# EAGLE schematic ArduinoSkypeIndicator (EAGLE 9.6.1)
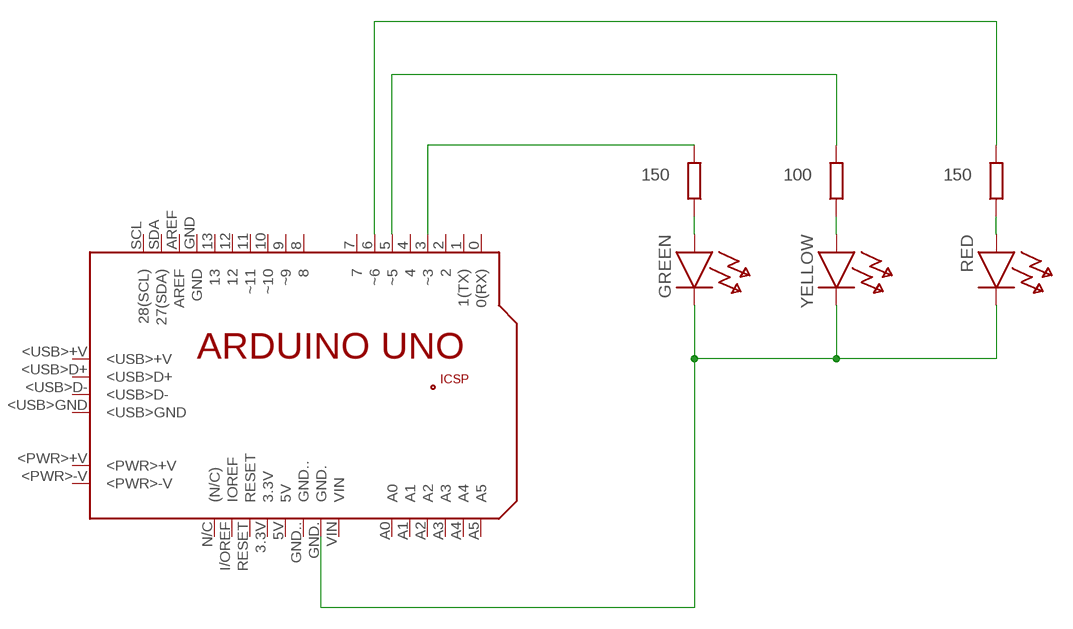
[diagram p0: schematic, sheet 1]

## Parts
GREEN  LED  (no package)
PCB1  ARDUINO_UNO  [ARDUINO_UNO]
RED  LED  (no package)
YELLOW  LED  (no package)

## Nets
100: PCB1.5(~5)
150: PCB1.3(~3) PCB1.6(~6)
N$1: GREEN.C PCB1.GND. RED.C YELLOW.C
N$2: GREEN.A
N$3: YELLOW.A
N$4: RED.A
Unconnected: PCB1.0(0(RX)) PCB1.1(1(TX)) PCB1.2 PCB1.3.3V PCB1.4 PCB1.5V PCB1.7 PCB1.8 PCB1.9(~9) PCB1.10(~10) PCB1.11(~11) PCB1.12 PCB1.13 PCB1.+5V PCB1.<PWR>+V PCB1.<PWR>-V PCB1.<USB>+V PCB1.<USB>D+ PCB1.<USB>D- PCB1.<USB>GND PCB1.A0 PCB1.A1 PCB1.A2 PCB1.A3 PCB1.A4 PCB1.A5 PCB1.AREF PCB1.GND PCB1.GND.. PCB1.GND_ PCB1.I/OREF(IOREF) PCB1.MISO PCB1.MOSI PCB1.N/C((N/C)) PCB1.RESET PCB1.RESET. PCB1.SCK PCB1.SCL(28(SCL)) PCB1.SDA(27(SDA)) PCB1.VIN

## Library data of the parts
GREEN RED YELLOW = ngspice-simulation:LED: Diode
PCB1 = E14_Arduino_revC:ARDUINO_UNO: Device for representing an Arduino Uno board with a footprint in an EAGLE design. Created by Dave Young for Element14. More EAGLE documentation at: http://www.element14.com/community/community/knode/cadsoft_eagle